# EAGLE schematic Sensor-Breakout-Board (EAGLE 5.12)

## Sheet 1 of 8
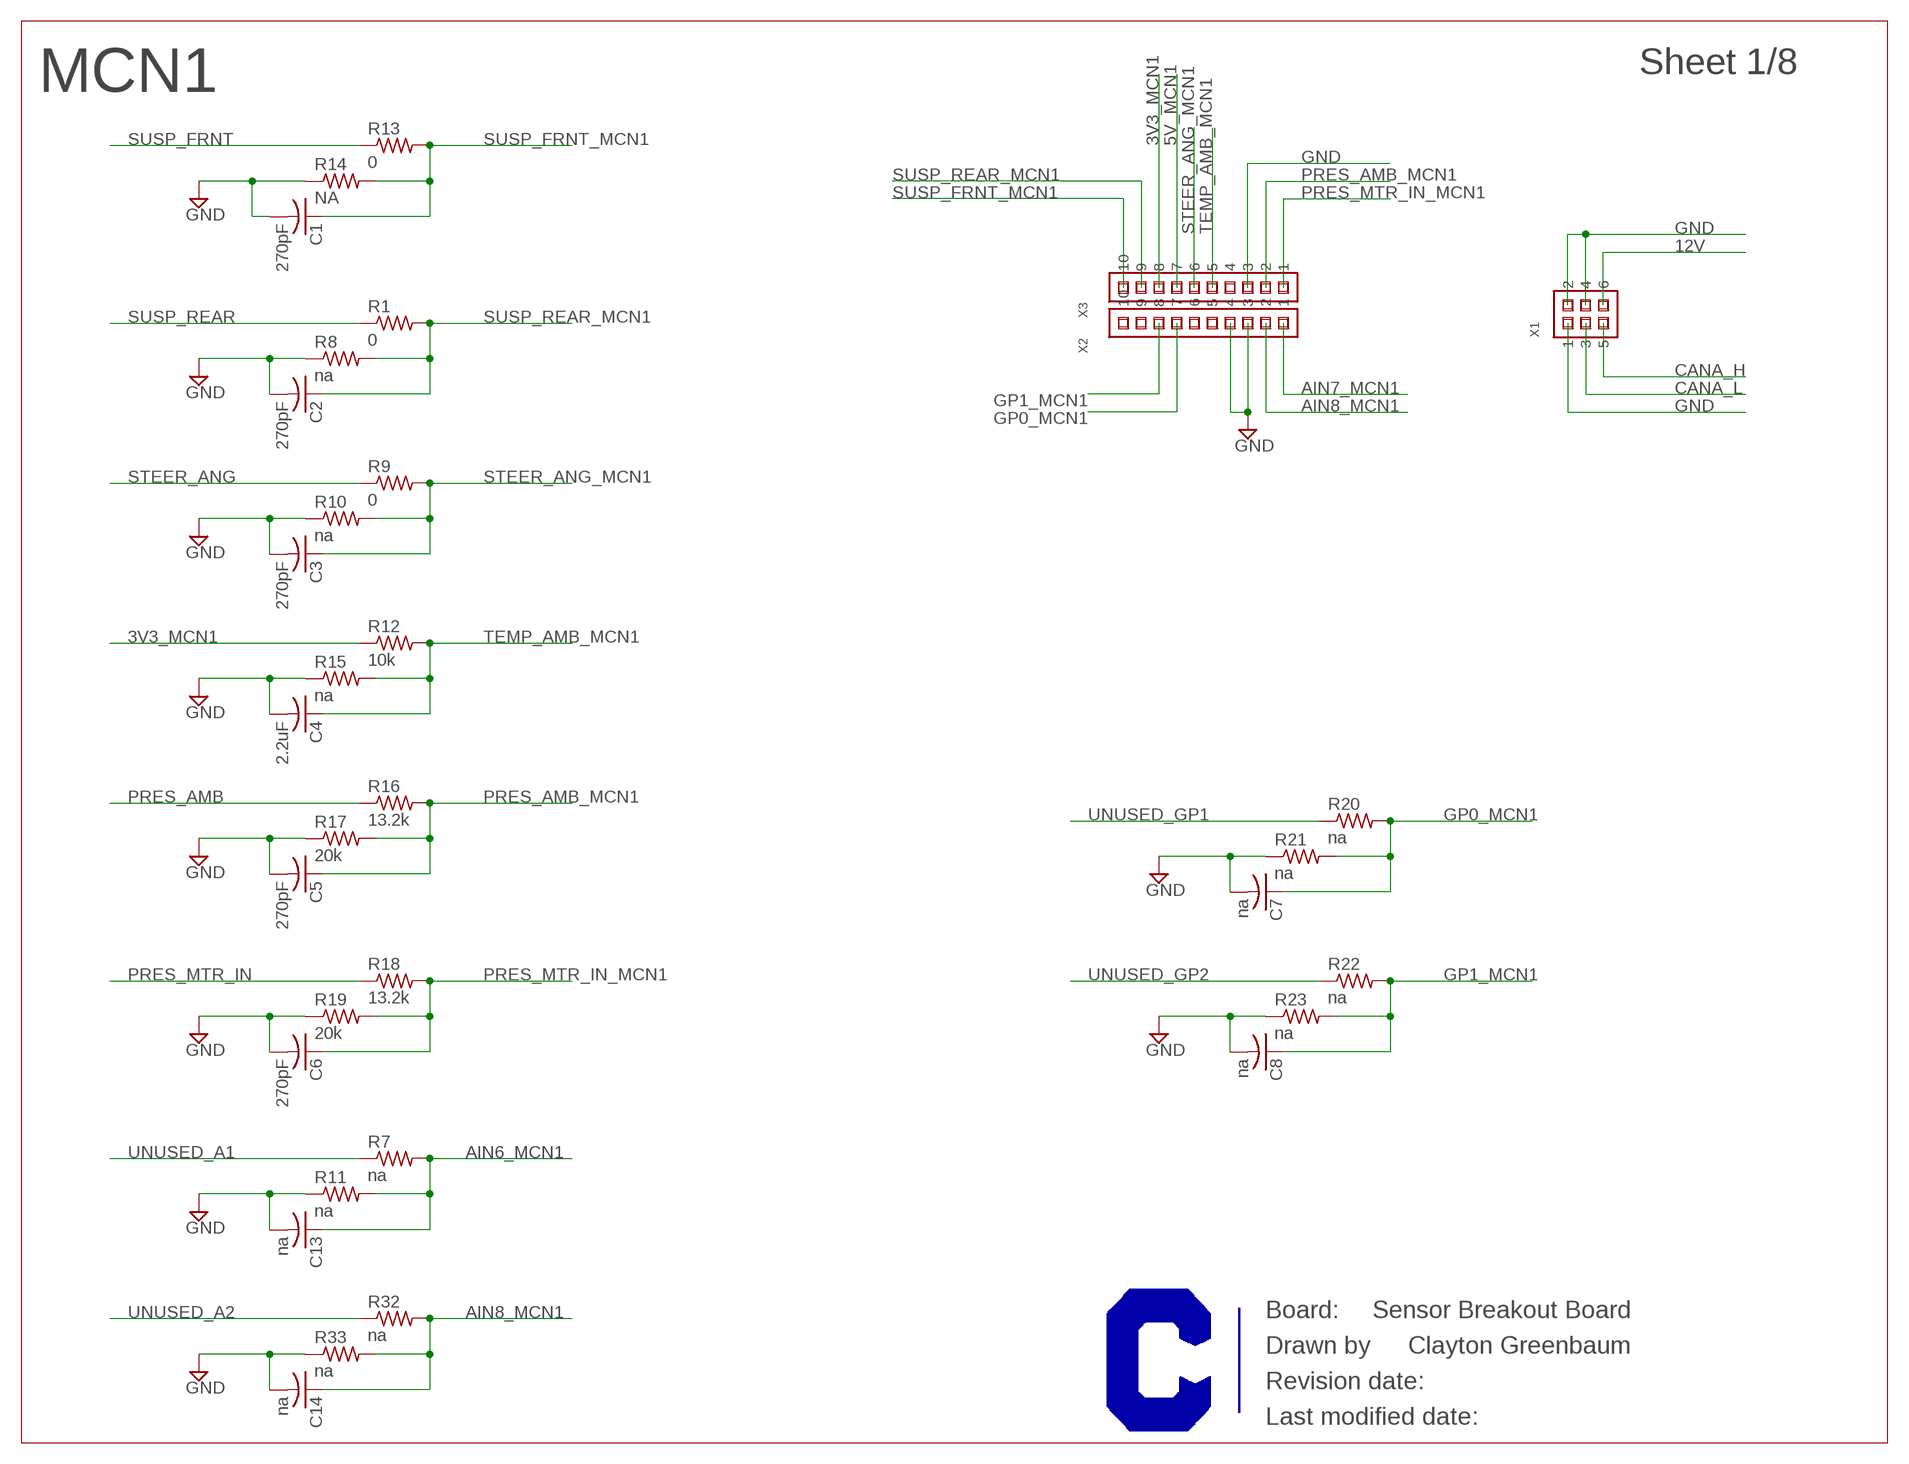
[diagram p0: schematic, sheet 1]

### Parts
C1  270pF  C-USC0603  [C0603]
C2  270pF  C-USC0603  [C0603]
C3  270pF  C-USC0603  [C0603]
C4  2.2uF  C-USC0603  [C0603]
C5  270pF  C-USC0603  [C0603]
C6  270pF  C-USC0603  [C0603]
C7  na  C-USC0603  [C0603]
C8  na  C-USC0603  [C0603]
C13  na  C-USC0603  [C0603]
C14  na  C-USC0603  [C0603]
R1  0  R-US_R0603  [R0603]
R7  na  R-US_R0603  [R0603]
R8  na  R-US_R0603  [R0603]
R9  0  R-US_R0603  [R0603]
R10  na  R-US_R0603  [R0603]
R11  na  R-US_R0603  [R0603]
R12  10k  R-US_R0603  [R0603]
R13  0  R-US_R0603  [R0603]
R14  NA  R-US_R0603  [R0603]
R15  na  R-US_R0603  [R0603]
R16  13.2k  R-US_R0603  [R0603]
R17  20k  R-US_R0603  [R0603]
R18  13.2k  R-US_R0603  [R0603]
R19  20k  R-US_R0603  [R0603]
R20  na  R-US_R0603  [R0603]
R21  na  R-US_R0603  [R0603]
R22  na  R-US_R0603  [R0603]
R23  na  R-US_R0603  [R0603]
R32  na  R-US_R0603  [R0603]
R33  na  R-US_R0603  [R0603]
X1  M22-71403XX  [M22-71403XX]
X2  M22-71310XX  [M22-71310XX]
X3  M22-71310XX  [M22-71310XX]

### Nets
3V3_MCN1: R12.1 X3.8
5V_MCN1: X3.7
12V: X1.6 ; also sheet 2,3,4,5,6,7
AIN6_MCN1: C13.1 R7.2 R11.2
AIN7_MCN1: X2.1
AIN8_MCN1: C14.1 R32.2 R33.2 X2.2
CANA_H: X1.5 ; also sheet 2,3,5,6,7
CANA_L: X1.3 ; also sheet 2,3,5,6,7
GND: C1.2 C2.2 C3.2 C4.2 C5.2 C6.2 C7.2 C8.2 C13.2 C14.2 R8.1 R10.1 R11.1 R14.1 R15.1 R17.1 R19.1 R21.1 R23.1 R33.1 X1.1 X1.2 X1.4 X2.3 X2.4 X3.3 ; also sheet 2,3,4,5,6,7
GP0_MCN1: C7.1 R20.2 R21.2 X2.7
GP1_MCN1: C8.1 R22.2 R23.2 X2.8
PRES_AMB: R16.1 ; also sheet 7
PRES_AMB_MCN1: C5.1 R16.2 R17.2 X3.2
PRES_MTR_IN: R18.1 ; also sheet 7
PRES_MTR_IN_MCN1: C6.1 R18.2 R19.2 X3.1
STEER_ANG: R9.1 ; also sheet 7
STEER_ANG_MCN1: C3.1 R9.2 R10.2 X3.6
SUSP_FRNT: R13.1 ; also sheet 7
SUSP_FRNT_MCN1: C1.1 R13.2 R14.2 X3.10
SUSP_REAR: R1.1 ; also sheet 7
SUSP_REAR_MCN1: C2.1 R1.2 R8.2 X3.9
TEMP_AMB_MCN1: C4.1 R12.2 R15.2 X3.5 ; also sheet 7
UNUSED_A1: R7.1
UNUSED_A2: R32.1
UNUSED_GP1: R20.1
UNUSED_GP2: R22.1
Unconnected: X2.5 X2.6 X2.9 X2.10 X3.4

### Notes on the sheet
- MCN1
- Sensor Breakout Board
- Clayton Greenbaum

## Sheet 2 of 8
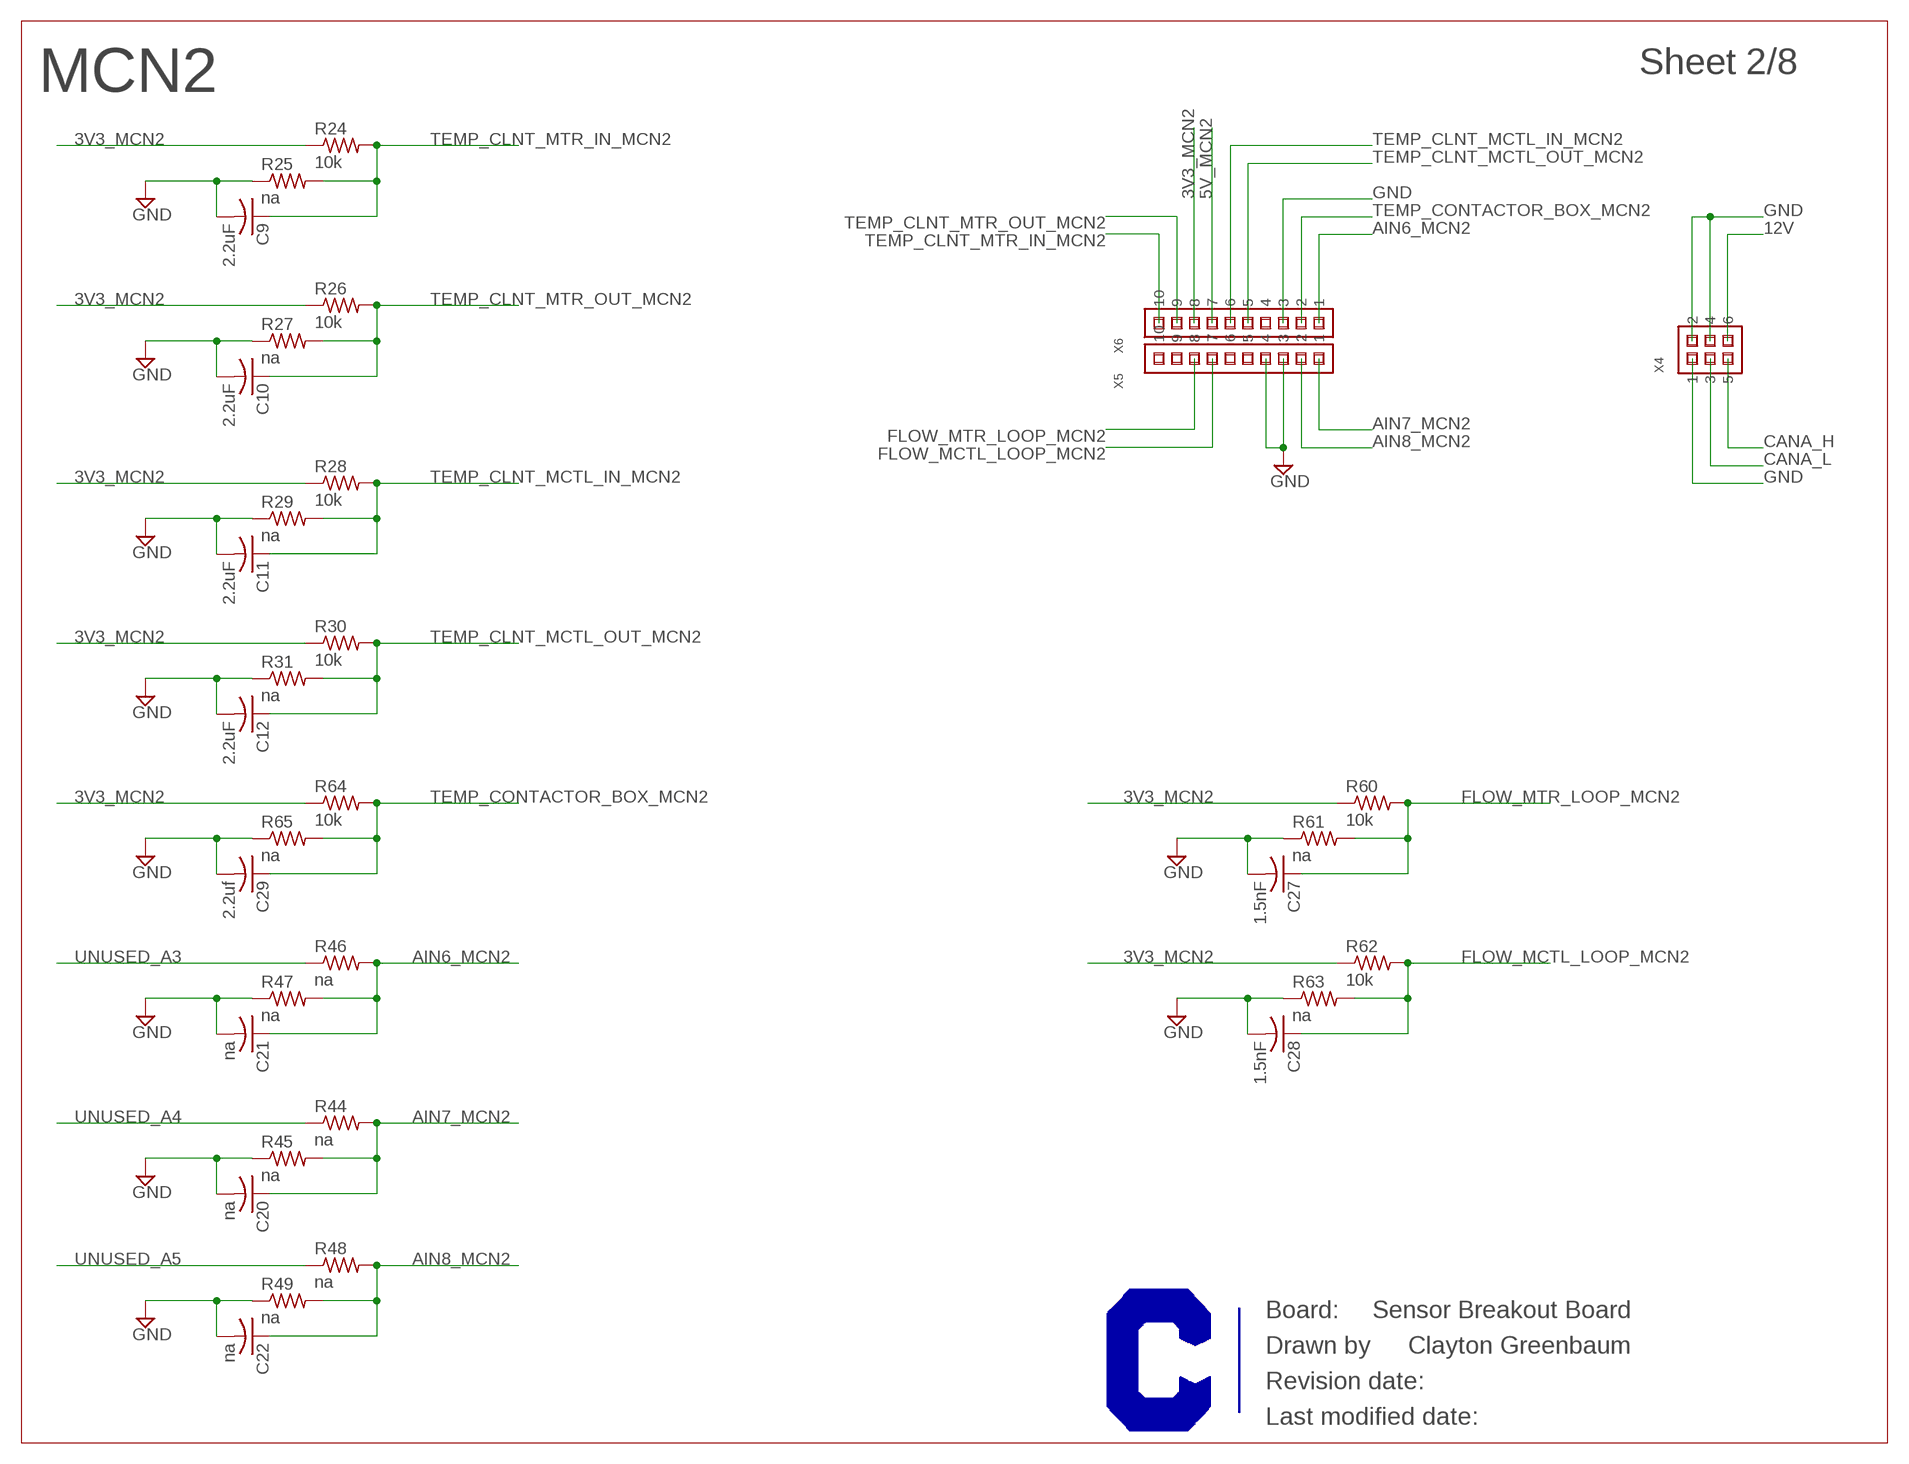
[diagram p1: schematic, sheet 2]

### Parts
C9  2.2uF  C-USC0603  [C0603]
C10  2.2uF  C-USC0603  [C0603]
C11  2.2uF  C-USC0603  [C0603]
C12  2.2uF  C-USC0603  [C0603]
C20  na  C-USC0603  [C0603]
C21  na  C-USC0603  [C0603]
C22  na  C-USC0603  [C0603]
C27  1.5nF  C-USC0603  [C0603]
C28  1.5nF  C-USC0603  [C0603]
C29  2.2uf  C-USC0603  [C0603]
R24  10k  R-US_R0603  [R0603]
R25  na  R-US_R0603  [R0603]
R26  10k  R-US_R0603  [R0603]
R27  na  R-US_R0603  [R0603]
R28  10k  R-US_R0603  [R0603]
R29  na  R-US_R0603  [R0603]
R30  10k  R-US_R0603  [R0603]
R31  na  R-US_R0603  [R0603]
R44  na  R-US_R0603  [R0603]
R45  na  R-US_R0603  [R0603]
R46  na  R-US_R0603  [R0603]
R47  na  R-US_R0603  [R0603]
R48  na  R-US_R0603  [R0603]
R49  na  R-US_R0603  [R0603]
R60  10k  R-US_R0603  [R0603]
R61  na  R-US_R0603  [R0603]
R62  10k  R-US_R0603  [R0603]
R63  na  R-US_R0603  [R0603]
R64  10k  R-US_R0603  [R0603]
R65  na  R-US_R0603  [R0603]
X4  M22-71403XX  [M22-71403XX]
X5  M22-71310XX  [M22-71310XX]
X6  M22-71310XX  [M22-71310XX]

### Nets
3V3_MCN2: R24.1 R26.1 R28.1 R30.1 R60.1 R62.1 R64.1 X6.8
5V_MCN2: X6.7
12V: X4.6 ; also sheet 1,3,4,5,6,7
AIN6_MCN2: C21.1 R46.2 R47.2 X6.1
AIN7_MCN2: C20.1 R44.2 R45.2 X5.1
AIN8_MCN2: C22.1 R48.2 R49.2 X5.2
CANA_H: X4.5 ; also sheet 1,3,5,6,7
CANA_L: X4.3 ; also sheet 1,3,5,6,7
FLOW_MCTL_LOOP_MCN2: C28.1 R62.2 R63.2 X5.7
FLOW_MTR_LOOP_MCN2: C27.1 R60.2 R61.2 X5.8
GND: C9.2 C10.2 C11.2 C12.2 C20.2 C21.2 C22.2 C27.2 C28.2 C29.2 R25.1 R27.1 R29.1 R31.1 R45.1 R47.1 R49.1 R61.1 R63.1 R65.1 X4.1 X4.2 X4.4 X5.3 X5.4 X6.3 ; also sheet 1,3,4,5,6,7
TEMP_CLNT_MCTL_IN_MCN2: C11.1 R28.2 R29.2 X6.6
TEMP_CLNT_MCTL_OUT_MCN2: C12.1 R30.2 R31.2 X6.5
TEMP_CLNT_MTR_IN_MCN2: C9.1 R24.2 R25.2 X6.10
TEMP_CLNT_MTR_OUT_MCN2: C10.1 R26.2 R27.2 X6.9
TEMP_CONTACTOR_BOX_MCN2: C29.1 R64.2 R65.2 X6.2
UNUSED_A3: R46.1
UNUSED_A4: R44.1
UNUSED_A5: R48.1
Unconnected: X5.5 X5.6 X5.9 X5.10 X6.4

### Notes on the sheet
- MCN2
- Sensor Breakout Board
- Clayton Greenbaum

## Sheet 3 of 8
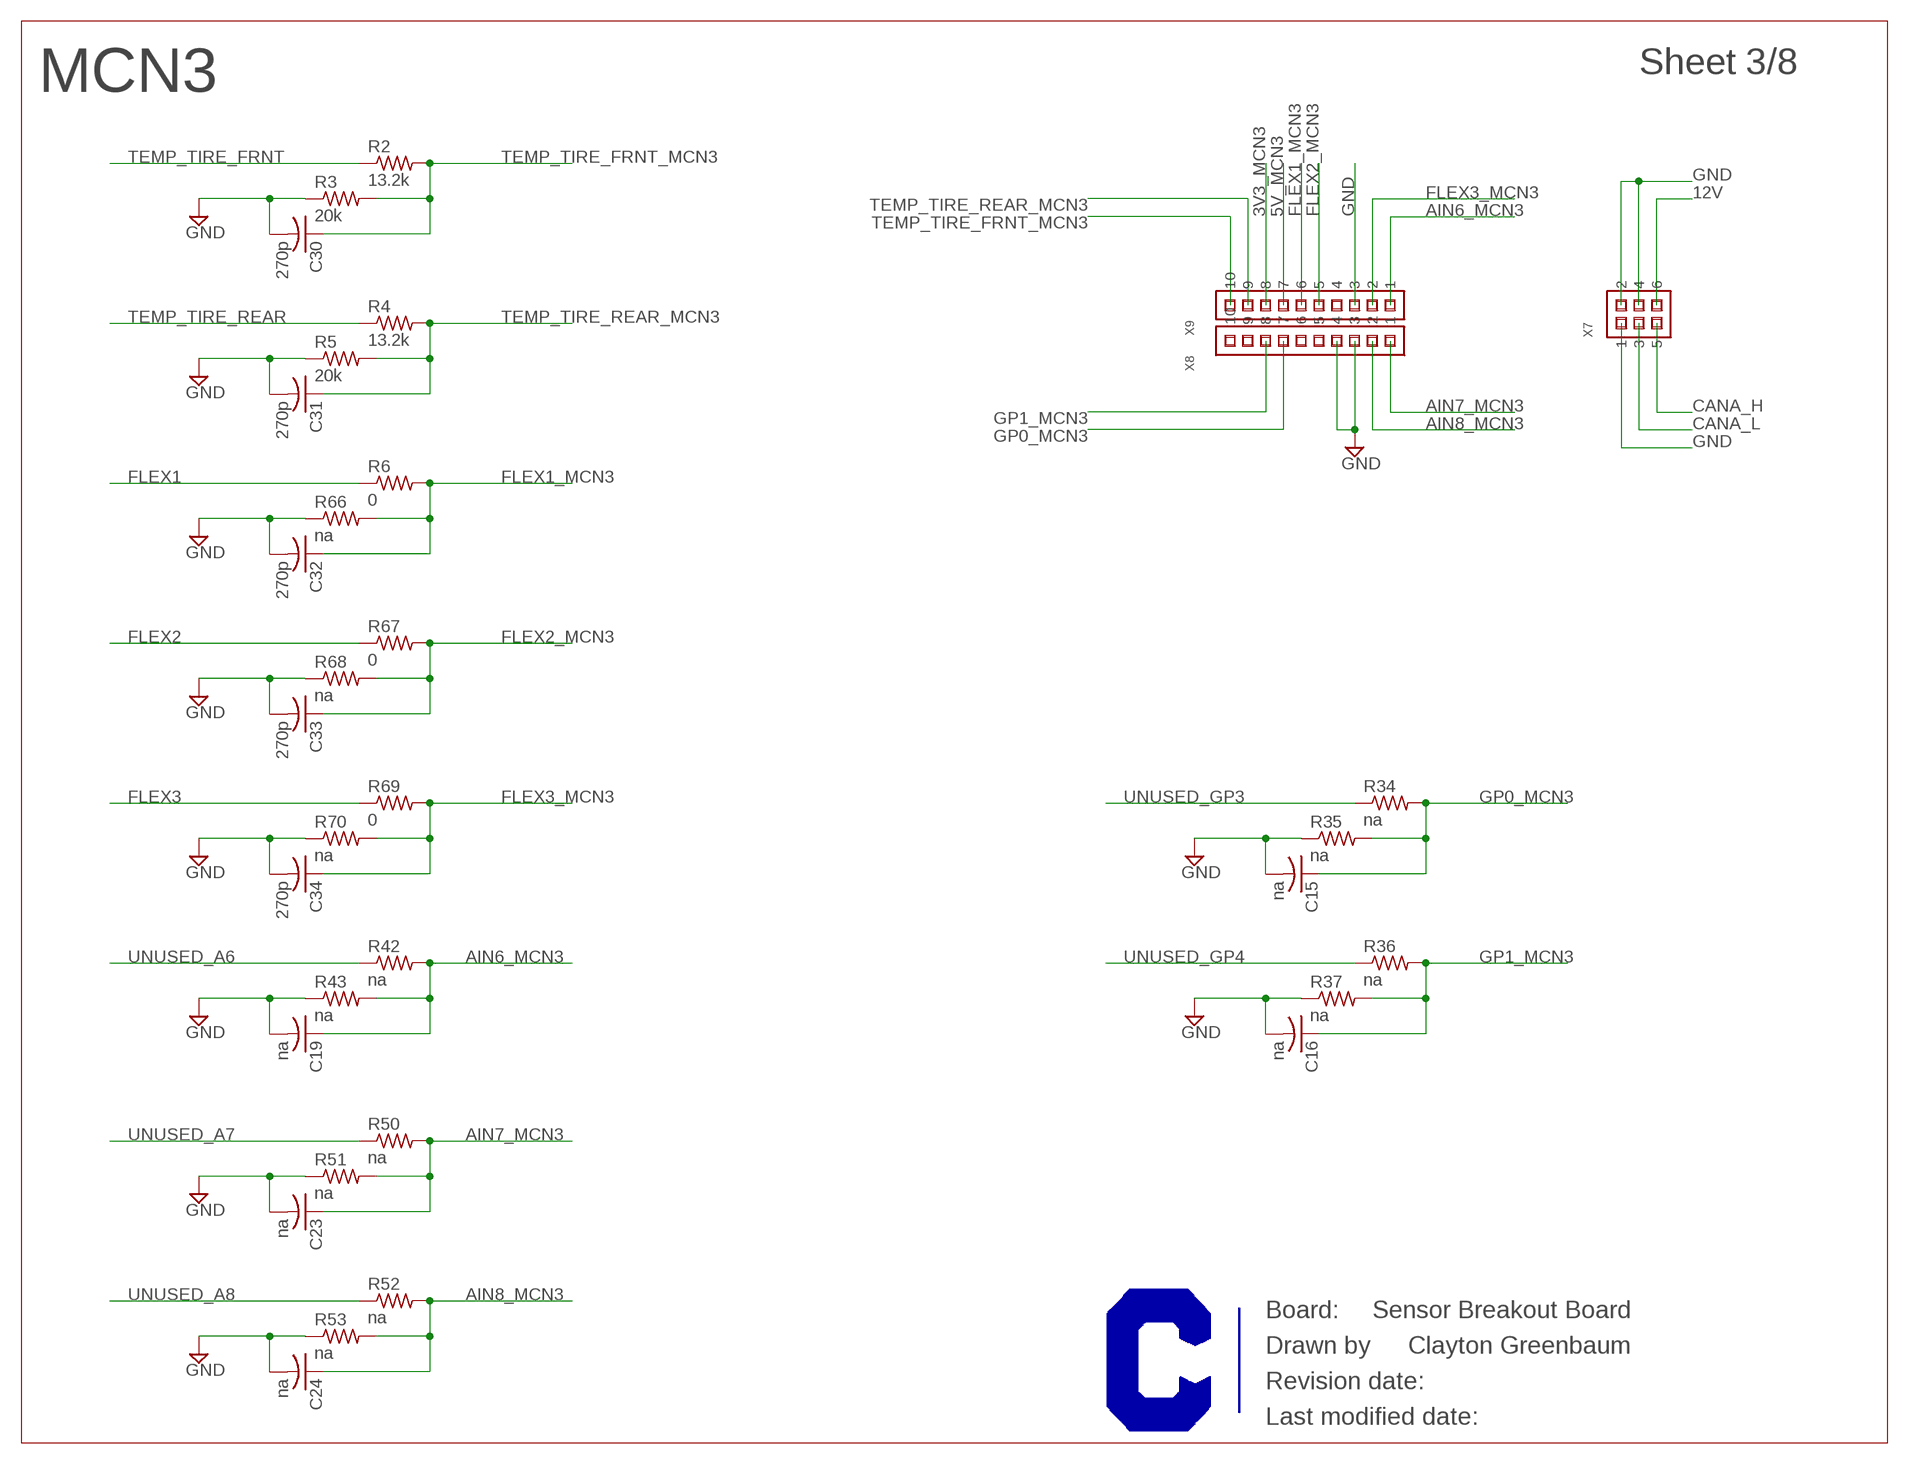
[diagram p2: schematic, sheet 3]

### Parts
C15  na  C-USC0603  [C0603]
C16  na  C-USC0603  [C0603]
C19  na  C-USC0603  [C0603]
C23  na  C-USC0603  [C0603]
C24  na  C-USC0603  [C0603]
C30  270p  C-USC0603  [C0603]
C31  270p  C-USC0603  [C0603]
C32  270p  C-USC0603  [C0603]
C33  270p  C-USC0603  [C0603]
C34  270p  C-USC0603  [C0603]
R2  13.2k  R-US_R0603  [R0603]
R3  20k  R-US_R0603  [R0603]
R4  13.2k  R-US_R0603  [R0603]
R5  20k  R-US_R0603  [R0603]
R6  0  R-US_R0603  [R0603]
R34  na  R-US_R0603  [R0603]
R35  na  R-US_R0603  [R0603]
R36  na  R-US_R0603  [R0603]
R37  na  R-US_R0603  [R0603]
R42  na  R-US_R0603  [R0603]
R43  na  R-US_R0603  [R0603]
R50  na  R-US_R0603  [R0603]
R51  na  R-US_R0603  [R0603]
R52  na  R-US_R0603  [R0603]
R53  na  R-US_R0603  [R0603]
R66  na  R-US_R0603  [R0603]
R67  0  R-US_R0603  [R0603]
R68  na  R-US_R0603  [R0603]
R69  0  R-US_R0603  [R0603]
R70  na  R-US_R0603  [R0603]
X7  M22-71403XX  [M22-71403XX]
X8  M22-71310XX  [M22-71310XX]
X9  M22-71310XX  [M22-71310XX]

### Nets
3V3_MCN3: X9.8
5V_MCN3: X9.7
12V: X7.6 ; also sheet 1,2,4,5,6,7
AIN6_MCN3: C19.1 R42.2 R43.2 X9.1
AIN7_MCN3: C23.1 R50.2 R51.2 X8.1
AIN8_MCN3: C24.1 R52.2 R53.2 X8.2
CANA_H: X7.5 ; also sheet 1,2,5,6,7
CANA_L: X7.3 ; also sheet 1,2,5,6,7
FLEX1: R6.1 ; also sheet 7
FLEX1_MCN3: C32.1 R6.2 R66.2 X9.6
FLEX2: R67.1 ; also sheet 7
FLEX2_MCN3: C33.1 R67.2 R68.2 X9.5
FLEX3: R69.1 ; also sheet 7
FLEX3_MCN3: C34.1 R69.2 R70.2 X9.2
GND: C15.2 C16.2 C19.2 C23.2 C24.2 C30.2 C31.2 C32.2 C33.2 C34.2 R3.1 R5.1 R35.1 R37.1 R43.1 R51.1 R53.1 R66.1 R68.1 R70.1 X7.1 X7.2 X7.4 X8.3 X8.4 X9.3 ; also sheet 1,2,4,5,6,7
GP0_MCN3: C15.1 R34.2 R35.2 X8.7
GP1_MCN3: C16.1 R36.2 R37.2 X8.8
TEMP_TIRE_FRNT: R2.1
TEMP_TIRE_FRNT_MCN3: C30.1 R2.2 R3.2 X9.10
TEMP_TIRE_REAR: R4.1
TEMP_TIRE_REAR_MCN3: C31.1 R4.2 R5.2 X9.9
UNUSED_A6: R42.1
UNUSED_A7: R50.1
UNUSED_A8: R52.1
UNUSED_GP3: R34.1
UNUSED_GP4: R36.1
Unconnected: X8.5 X8.6 X8.9 X8.10 X9.4

### Notes on the sheet
- MCN3
- Sensor Breakout Board
- Clayton Greenbaum

## Sheet 4 of 8
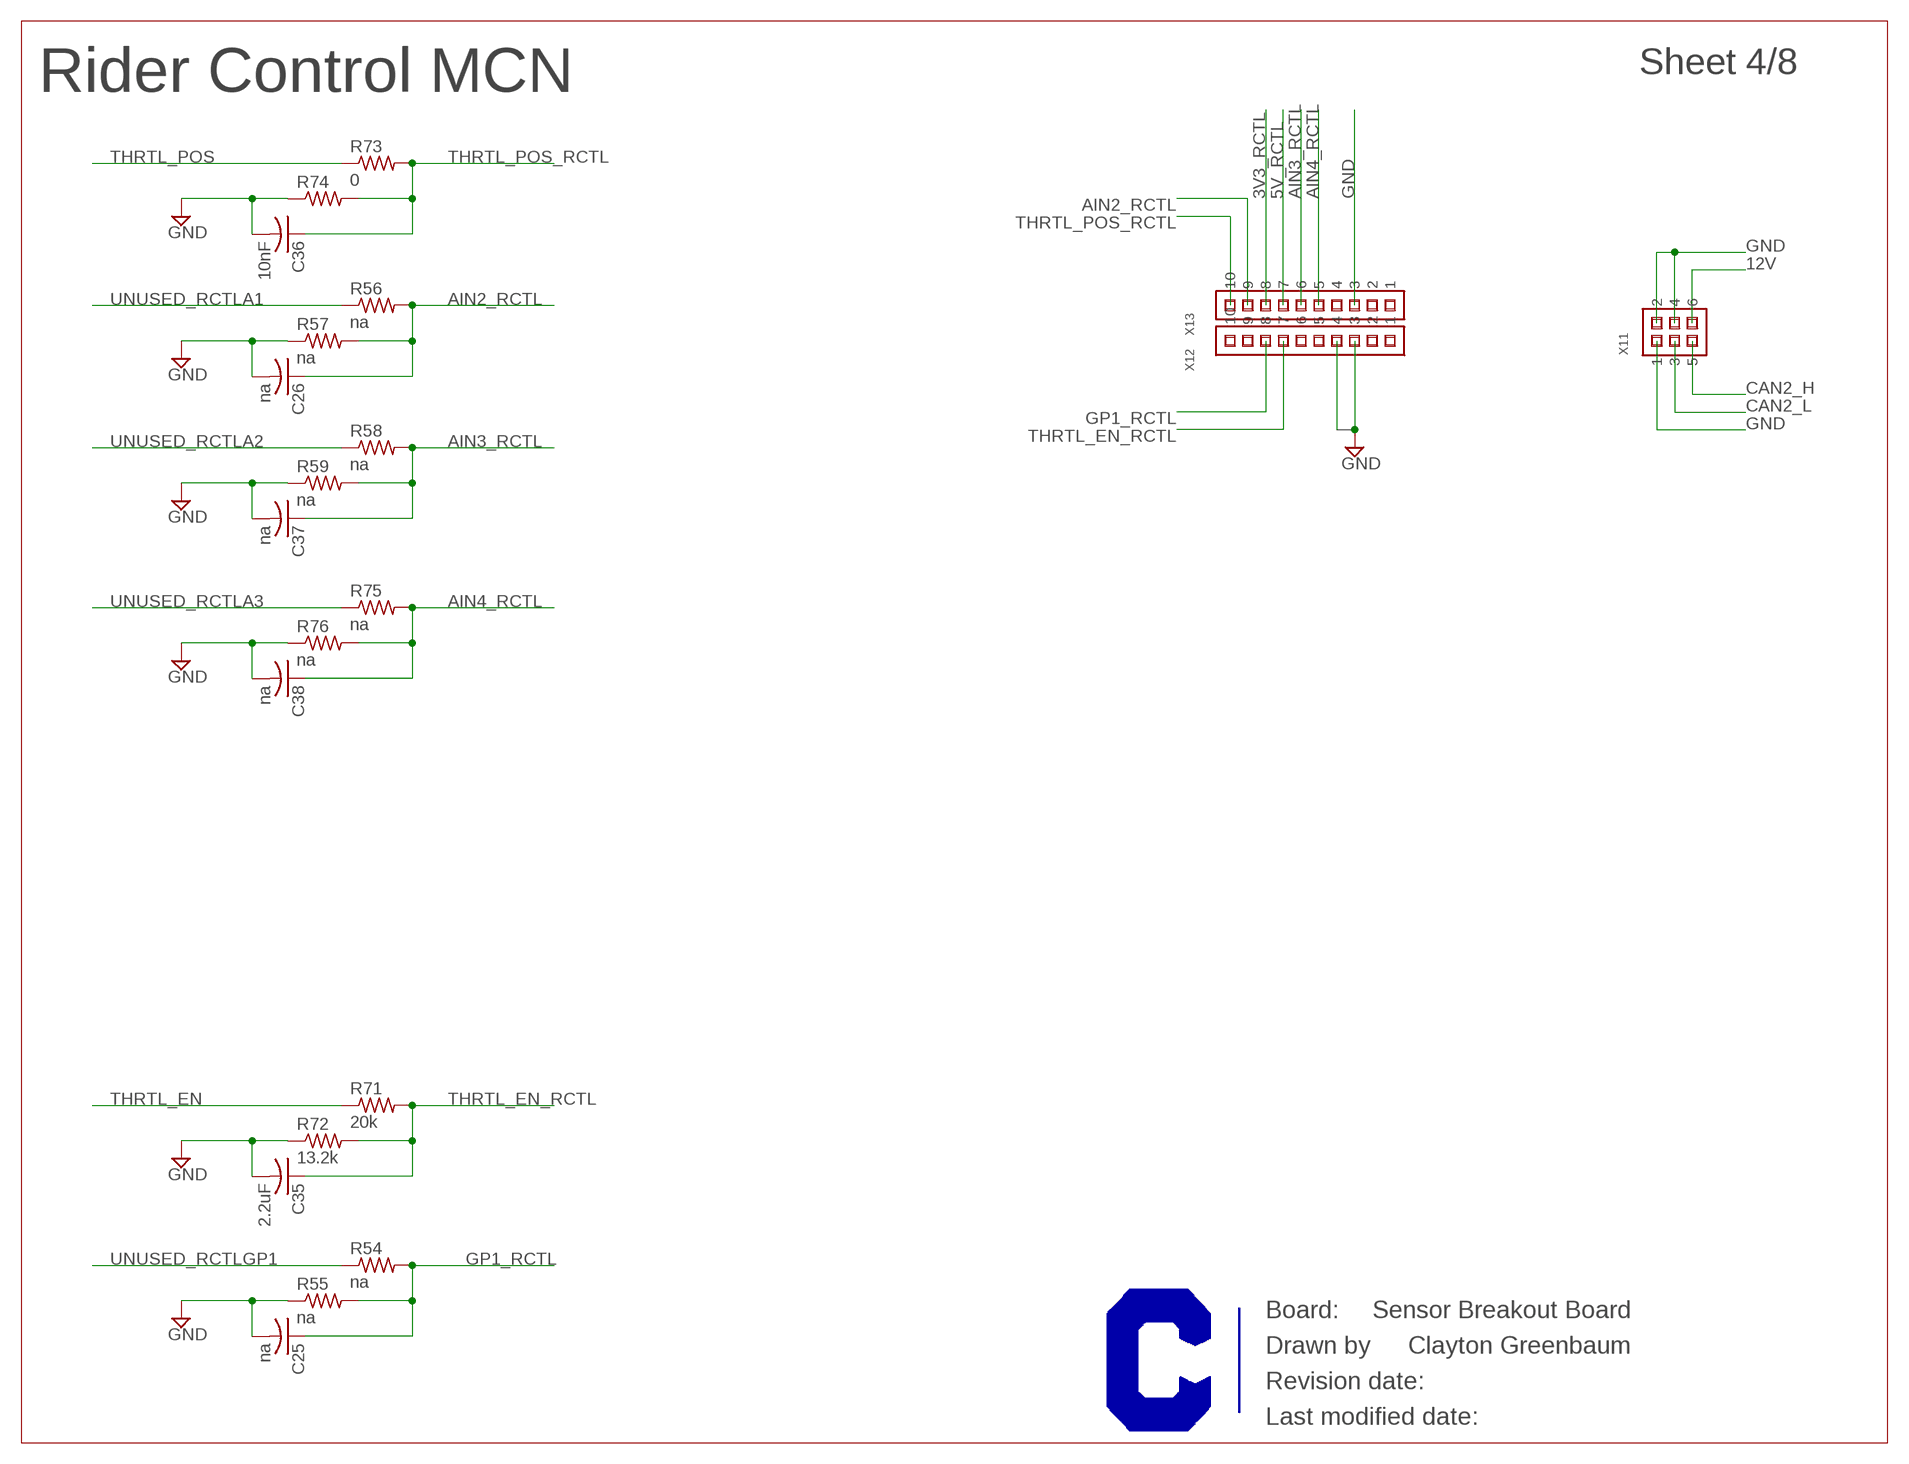
[diagram p3: schematic, sheet 4]

### Parts
C25  na  C-USC0603  [C0603]
C26  na  C-USC0603  [C0603]
C35  2.2uF  C-USC0603  [C0603]
C36  10nF  C-USC0603  [C0603]
C37  na  C-USC0603  [C0603]
C38  na  C-USC0603  [C0603]
R54  na  R-US_R0603  [R0603]
R55  na  R-US_R0603  [R0603]
R56  na  R-US_R0603  [R0603]
R57  na  R-US_R0603  [R0603]
R58  na  R-US_R0603  [R0603]
R59  na  R-US_R0603  [R0603]
R71  20k  R-US_R0603  [R0603]
R72  13.2k  R-US_R0603  [R0603]
R73  0  R-US_R0603  [R0603]
R74  R-US_R0603  [R0603]
R75  na  R-US_R0603  [R0603]
R76  na  R-US_R0603  [R0603]
X11  M22-71403XX  [M22-71403XX]
X12  M22-71310XX  [M22-71310XX]
X13  M22-71310XX  [M22-71310XX]

### Nets
3V3_RCTL: X13.8
5V_RCTL: X13.7
12V: X11.6 ; also sheet 1,2,3,5,6,7
AIN2_RCTL: C26.1 R56.2 R57.2 X13.9
AIN3_RCTL: C37.1 R58.2 R59.2 X13.6
AIN4_RCTL: C38.1 R75.2 R76.2 X13.5
CAN2_H: X11.5 ; also sheet 6,7
CAN2_L: X11.3 ; also sheet 6,7
GND: C25.2 C26.2 C35.2 C36.2 C37.2 C38.2 R55.1 R57.1 R59.1 R72.1 R74.1 R76.1 X11.1 X11.2 X11.4 X12.3 X13.3 ; also sheet 1,2,3,5,6,7
GP1_RCTL: C25.1 R54.2 R55.2 X12.8
N$82: X12.4
THRTL_EN: R71.1 ; also sheet 7
THRTL_EN_RCTL: C35.1 R71.2 R72.2 X12.7
THRTL_POS: R73.1 ; also sheet 7
THRTL_POS_RCTL: C36.1 R73.2 R74.2 X13.10
UNUSED_RCTLA1: R56.1
UNUSED_RCTLA2: R58.1
UNUSED_RCTLA3: R75.1
UNUSED_RCTLGP1: R54.1
Unconnected: X12.1 X12.2 X12.5 X12.6 X12.9 X12.10 X13.1 X13.2 X13.4

### Notes on the sheet
- Rider Control MCN
- Sensor Breakout Board
- Clayton Greenbaum

## Sheet 5 of 8
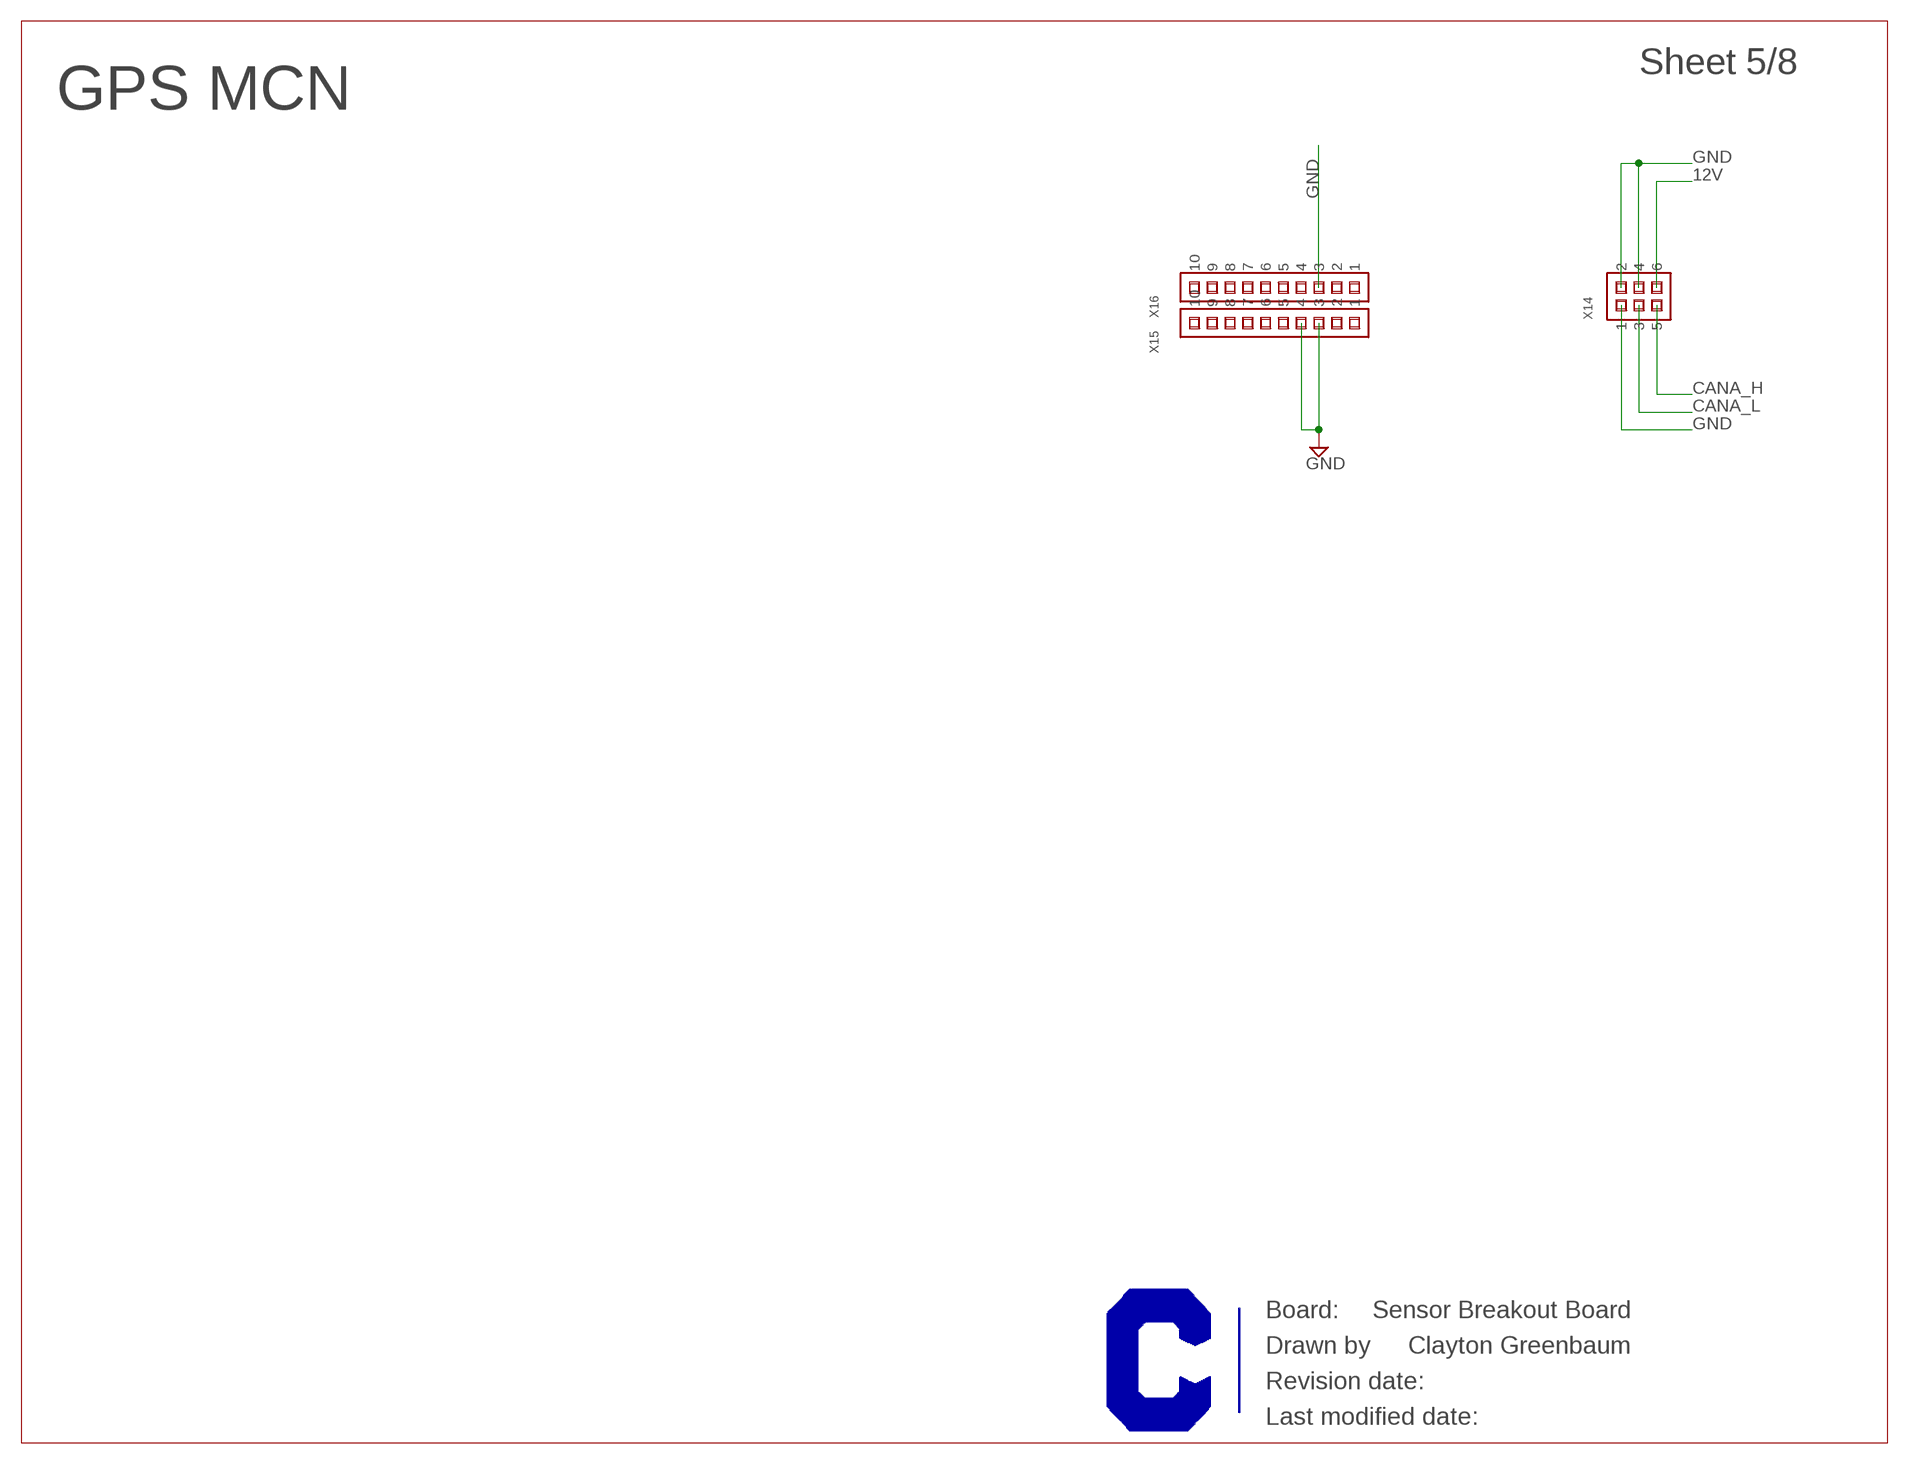
[diagram p4: schematic, sheet 5]

### Parts
X14  M22-71403XX  [M22-71403XX]
X15  M22-71310XX  [M22-71310XX]
X16  M22-71310XX  [M22-71310XX]

### Nets
12V: X14.6 ; also sheet 1,2,3,4,6,7
CANA_H: X14.5 ; also sheet 1,2,3,6,7
CANA_L: X14.3 ; also sheet 1,2,3,6,7
GND: X14.1 X14.2 X14.4 X15.3 X15.4 X16.3 ; also sheet 1,2,3,4,6,7
Unconnected: X15.1 X15.2 X15.5 X15.6 X15.7 X15.8 X15.9 X15.10 X16.1 X16.2 X16.4 X16.5 X16.6 X16.7 X16.8 X16.9 X16.10

### Notes on the sheet
- GPS MCN
- Sensor Breakout Board
- Clayton Greenbaum

## Sheet 6 of 8
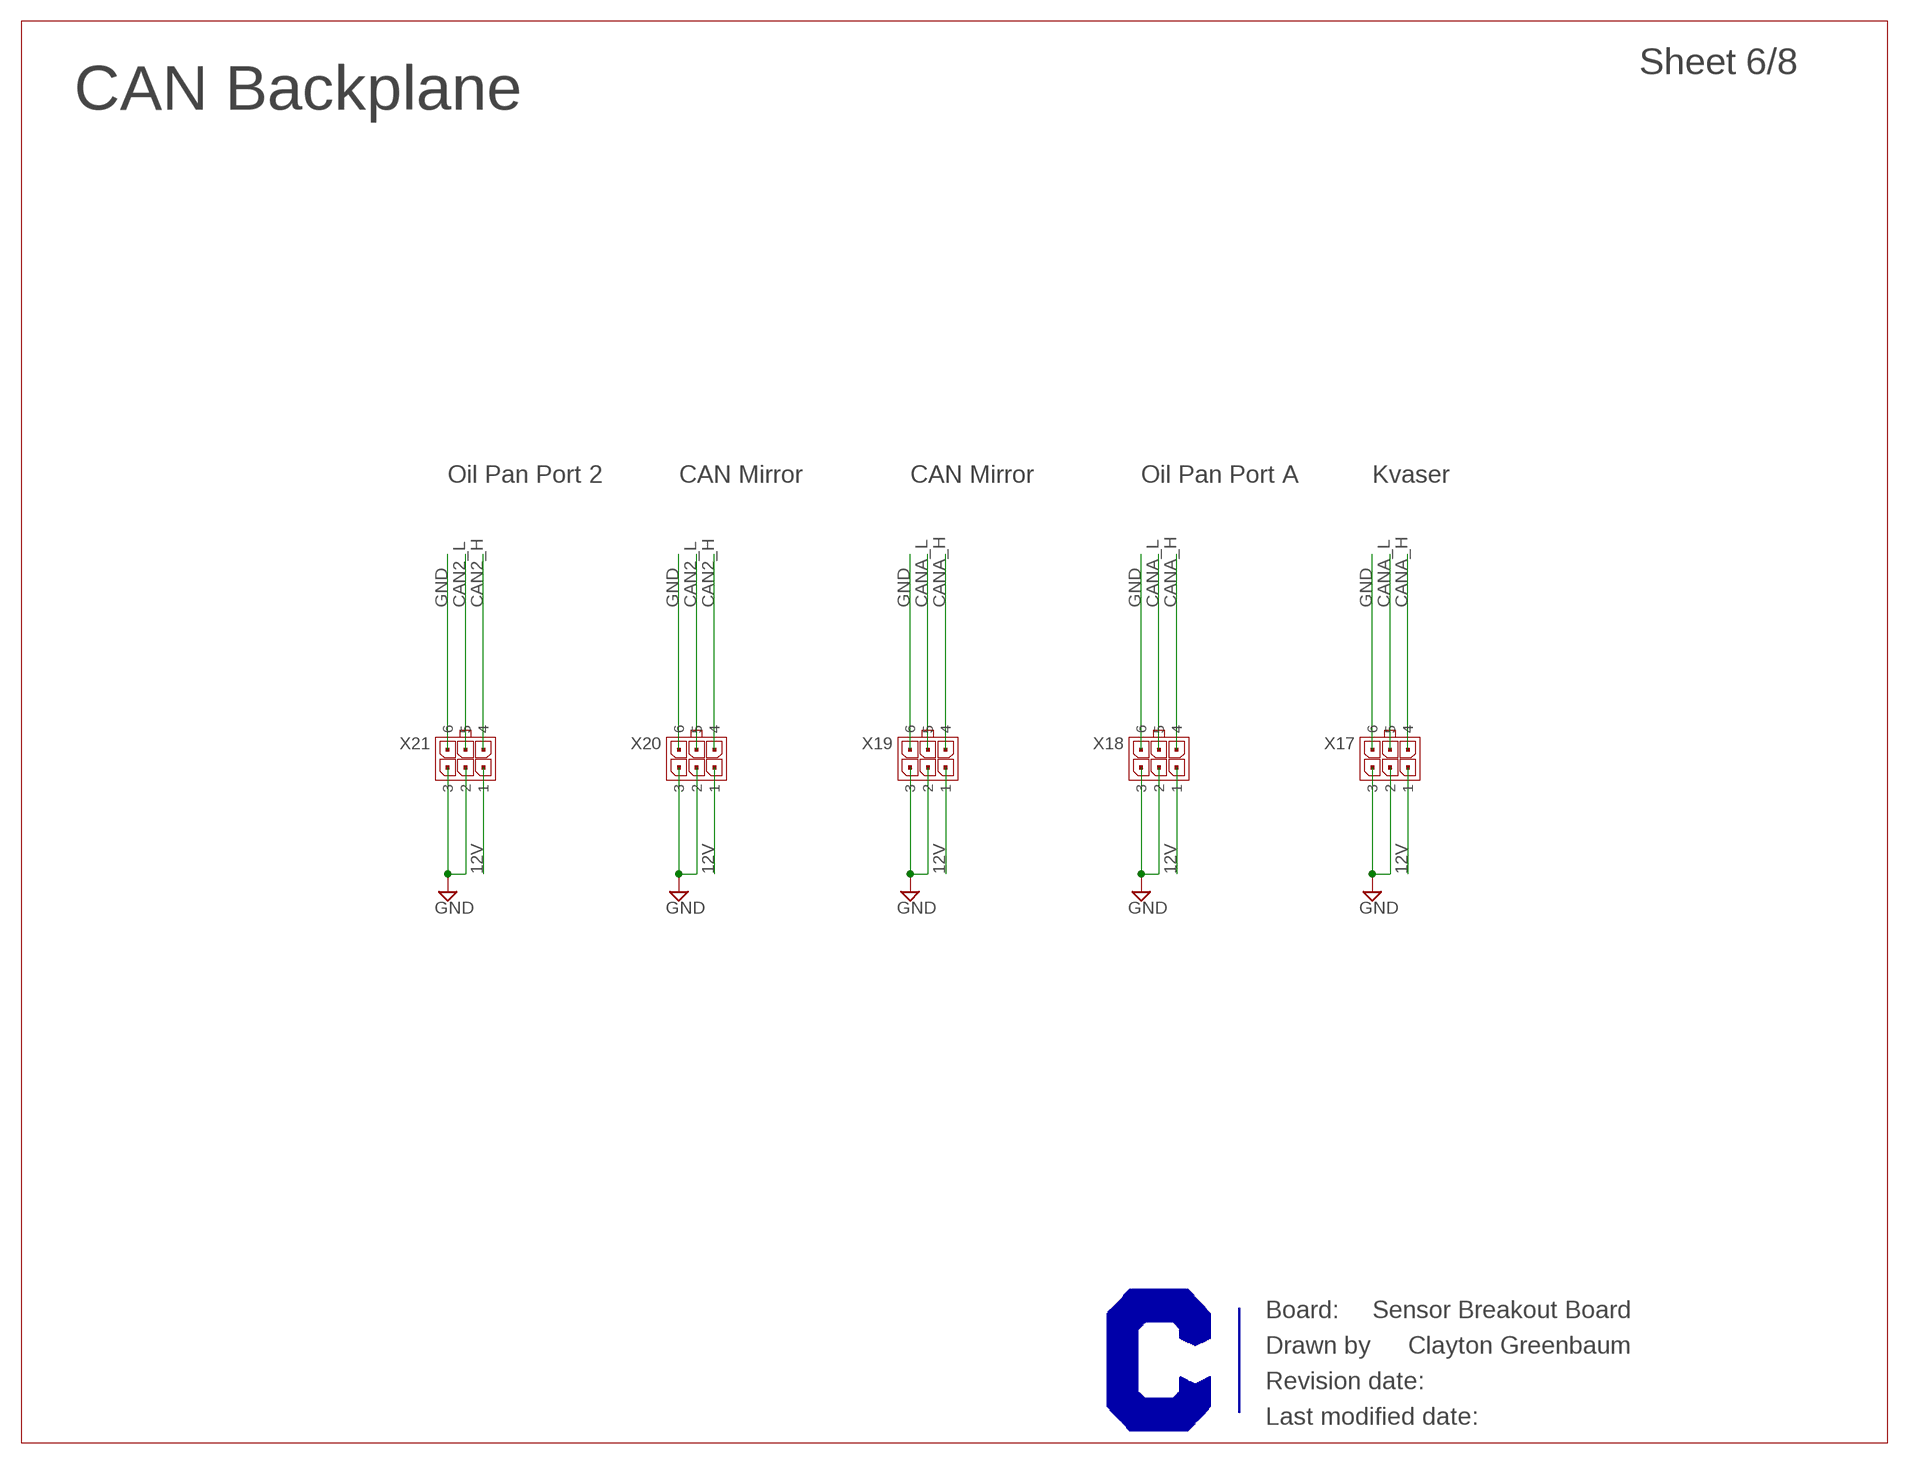
[diagram p5: schematic, sheet 6]

### Parts
X17  MICROFIT-06-DUAL-RA-SMD  [MICROFIT-6-DUAL-RA-SMD]
X18  MICROFIT-06-DUAL-RA-SMD  [MICROFIT-6-DUAL-RA-SMD]
X19  MICROFIT-06-DUAL-RA-SMD  [MICROFIT-6-DUAL-RA-SMD]
X20  MICROFIT-06-DUAL-RA-SMD  [MICROFIT-6-DUAL-RA-SMD]
X21  MICROFIT-06-DUAL-RA-SMD  [MICROFIT-6-DUAL-RA-SMD]

### Nets
12V: X17.1 X18.1 X19.1 X20.1 X21.1 ; also sheet 1,2,3,4,5,7
CAN2_H: X20.4 X21.4 ; also sheet 4,7
CAN2_L: X20.5 X21.5 ; also sheet 4,7
CANA_H: X17.4 X18.4 X19.4 ; also sheet 1,2,3,5,7
CANA_L: X17.5 X18.5 X19.5 ; also sheet 1,2,3,5,7
GND: X17.2 X17.3 X17.6 X18.2 X18.3 X18.6 X19.2 X19.3 X19.6 X20.2 X20.3 X20.6 X21.2 X21.3 X21.6 ; also sheet 1,2,3,4,5,7

### Notes on the sheet
- CAN Backplane
- Oil Pan Port 2 | CAN Mirror | CAN Mirror | Oil Pan Port A | Kvaser
- Sensor Breakout Board
- Clayton Greenbaum

## Sheet 7 of 8
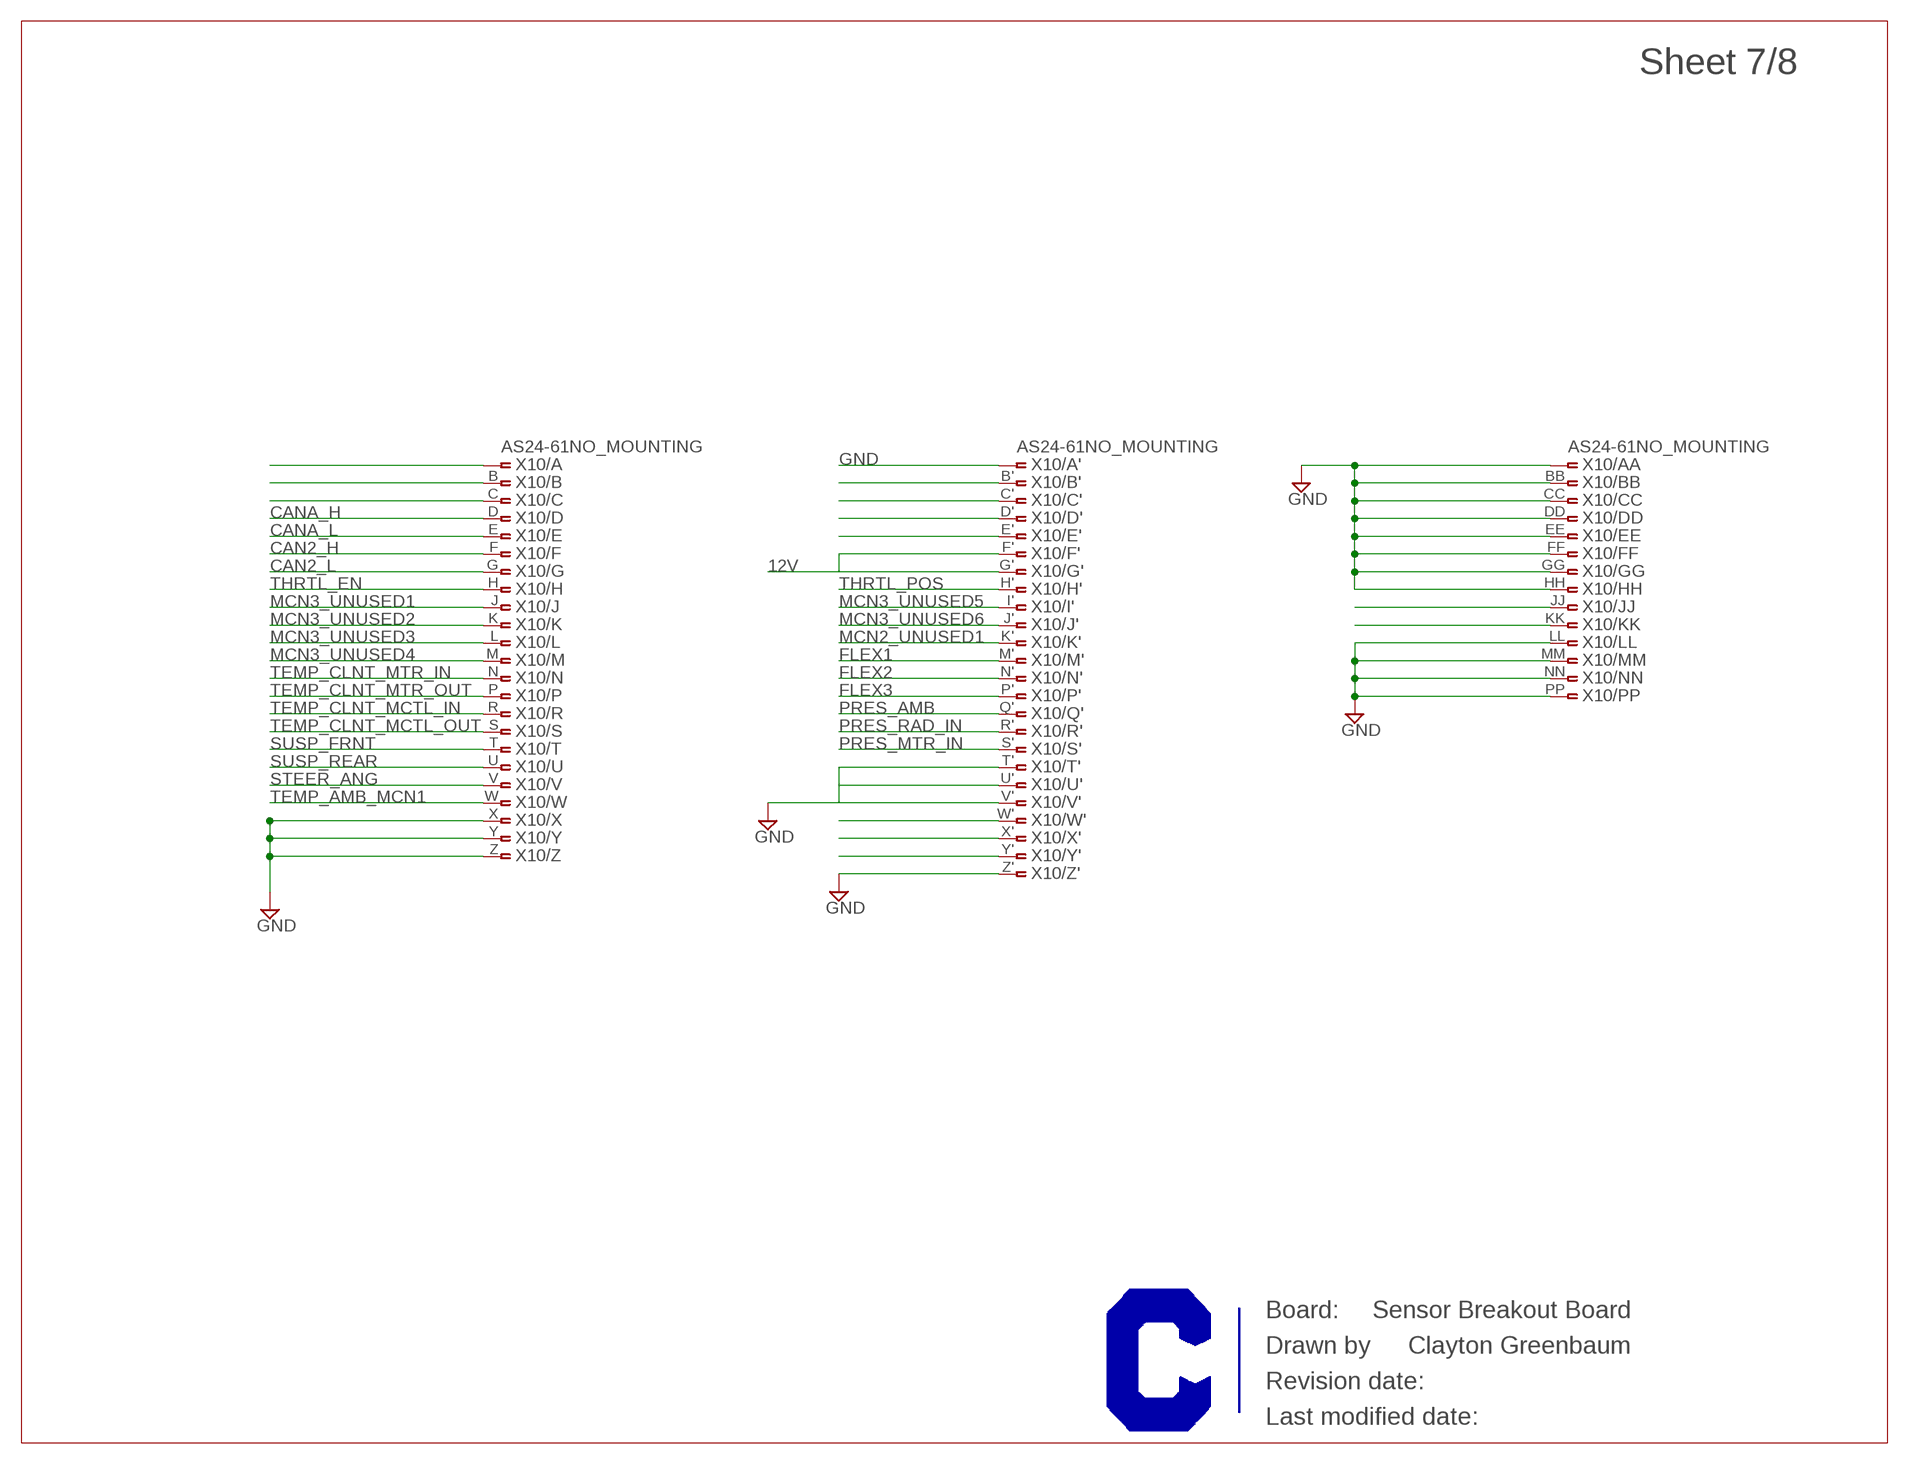
[diagram p6: schematic, sheet 7]

### Parts
X10  AS24-61NO_MOUNTING  [AS24-6_NO_MOUNTING]

### Nets
12V: X10.F' X10.G' ; also sheet 1,2,3,4,5,6
CAN2_H: X10.F ; also sheet 4,6
CAN2_L: X10.G ; also sheet 4,6
CANA_H: X10.D ; also sheet 1,2,3,5,6
CANA_L: X10.E ; also sheet 1,2,3,5,6
FLEX1: X10.M' ; also sheet 3
FLEX2: X10.N' ; also sheet 3
FLEX3: X10.P' ; also sheet 3
GND: X10.A' X10.AA X10.BB X10.CC X10.DD X10.EE X10.FF X10.GG X10.HH X10.LL X10.MM X10.NN X10.PP X10.T' X10.V' X10.X X10.Y X10.Z X10.Z' ; also sheet 1,2,3,4,5,6
MCN2_UNUSED1: X10.K'
MCN3_UNUSED1: X10.J
MCN3_UNUSED2: X10.K
MCN3_UNUSED3: X10.L
MCN3_UNUSED4: X10.M
MCN3_UNUSED5: X10.I'
MCN3_UNUSED6: X10.J'
N$106: X10.B
N$107: X10.C
N$111: X10.A
N$129: X10.B'
N$130: X10.C'
N$131: X10.D'
N$132: X10.E'
N$146: X10.U'
N$148: X10.W'
N$149: X10.X'
N$150: X10.Y'
N$160: X10.JJ
N$161: X10.KK
PRES_AMB: X10.Q' ; also sheet 1
PRES_MTR_IN: X10.S' ; also sheet 1
PRES_RAD_IN: X10.R'
STEER_ANG: X10.V ; also sheet 1
SUSP_FRNT: X10.T ; also sheet 1
SUSP_REAR: X10.U ; also sheet 1
TEMP_AMB_MCN1: X10.W ; also sheet 1
TEMP_CLNT_MCTL_IN: X10.R
TEMP_CLNT_MCTL_OUT: X10.S
TEMP_CLNT_MTR_IN: X10.N
TEMP_CLNT_MTR_OUT: X10.P
THRTL_EN: X10.H ; also sheet 4
THRTL_POS: X10.H' ; also sheet 4

### Notes on the sheet
- Sensor Breakout Board
- Clayton Greenbaum

## Sheet 8 of 8

## Library data of the parts
C1-C16 C19-C38 = resistor:C-US: CAPACITOR, American symbol
R1-R37 R42-R76 = rcl:R-US_: RESISTOR, American symbol
X1 X4 X7 X11 X14 = Harwin:M22-71403XX: M22-71403XX - 2x3 pos female header assy, 2.0mm pitch Datasheet: https://cdn.harwin.com/pdfs/M22-714.pdf; PARTNO: M22-7140342
X2 X3 X5 X6 X8 X9 X12 X13 X15 X16 = Harwin:M22-71310XX: Harwin M22-71310XX - 10pos single row female pin hdr, 2mm pitch Datasheet: https://cdn.harwin.com/pdfs/M22-713.pdf; PARTNO: M22-7131042
X10 = con-deutsch:AS24-61: DEUTSCH Connector
X17-X21 = Molex:MICROFIT-06-DUAL: Molex MicroFit 3.00mm Pitch Header, Surface Mount, Dual Row, 6 Circuits Note, November 2014: These come in three styles: Through-hole, with metal clip retention to PCB (not currently represented) (cheapest) SMD, with solder tab retention (-SMD) (more expensive, commonly stocked) SMD, with metal clip retention (-SMD-CLIP_RETENTION) (most expensive, not often stocked) Please use them in that order! Drawing: http://www.molex.com/pdm_docs/sd/430450609_sd.pdf (right-angle) Information: http://www.molex.com/molex/products/datasheet.jsp?part=active/0430450618_PCB_HEADERS.xml; PARTNO: 43045-0609